# Altium schematic sheet IO_Combo_SD.SchDoc: SD Card
size Tabloid; Date: 09/21/2024; Engineer: Terry D. Schevker; Revision: 1.0; SheetNumber: 3; SheetTotal: 5
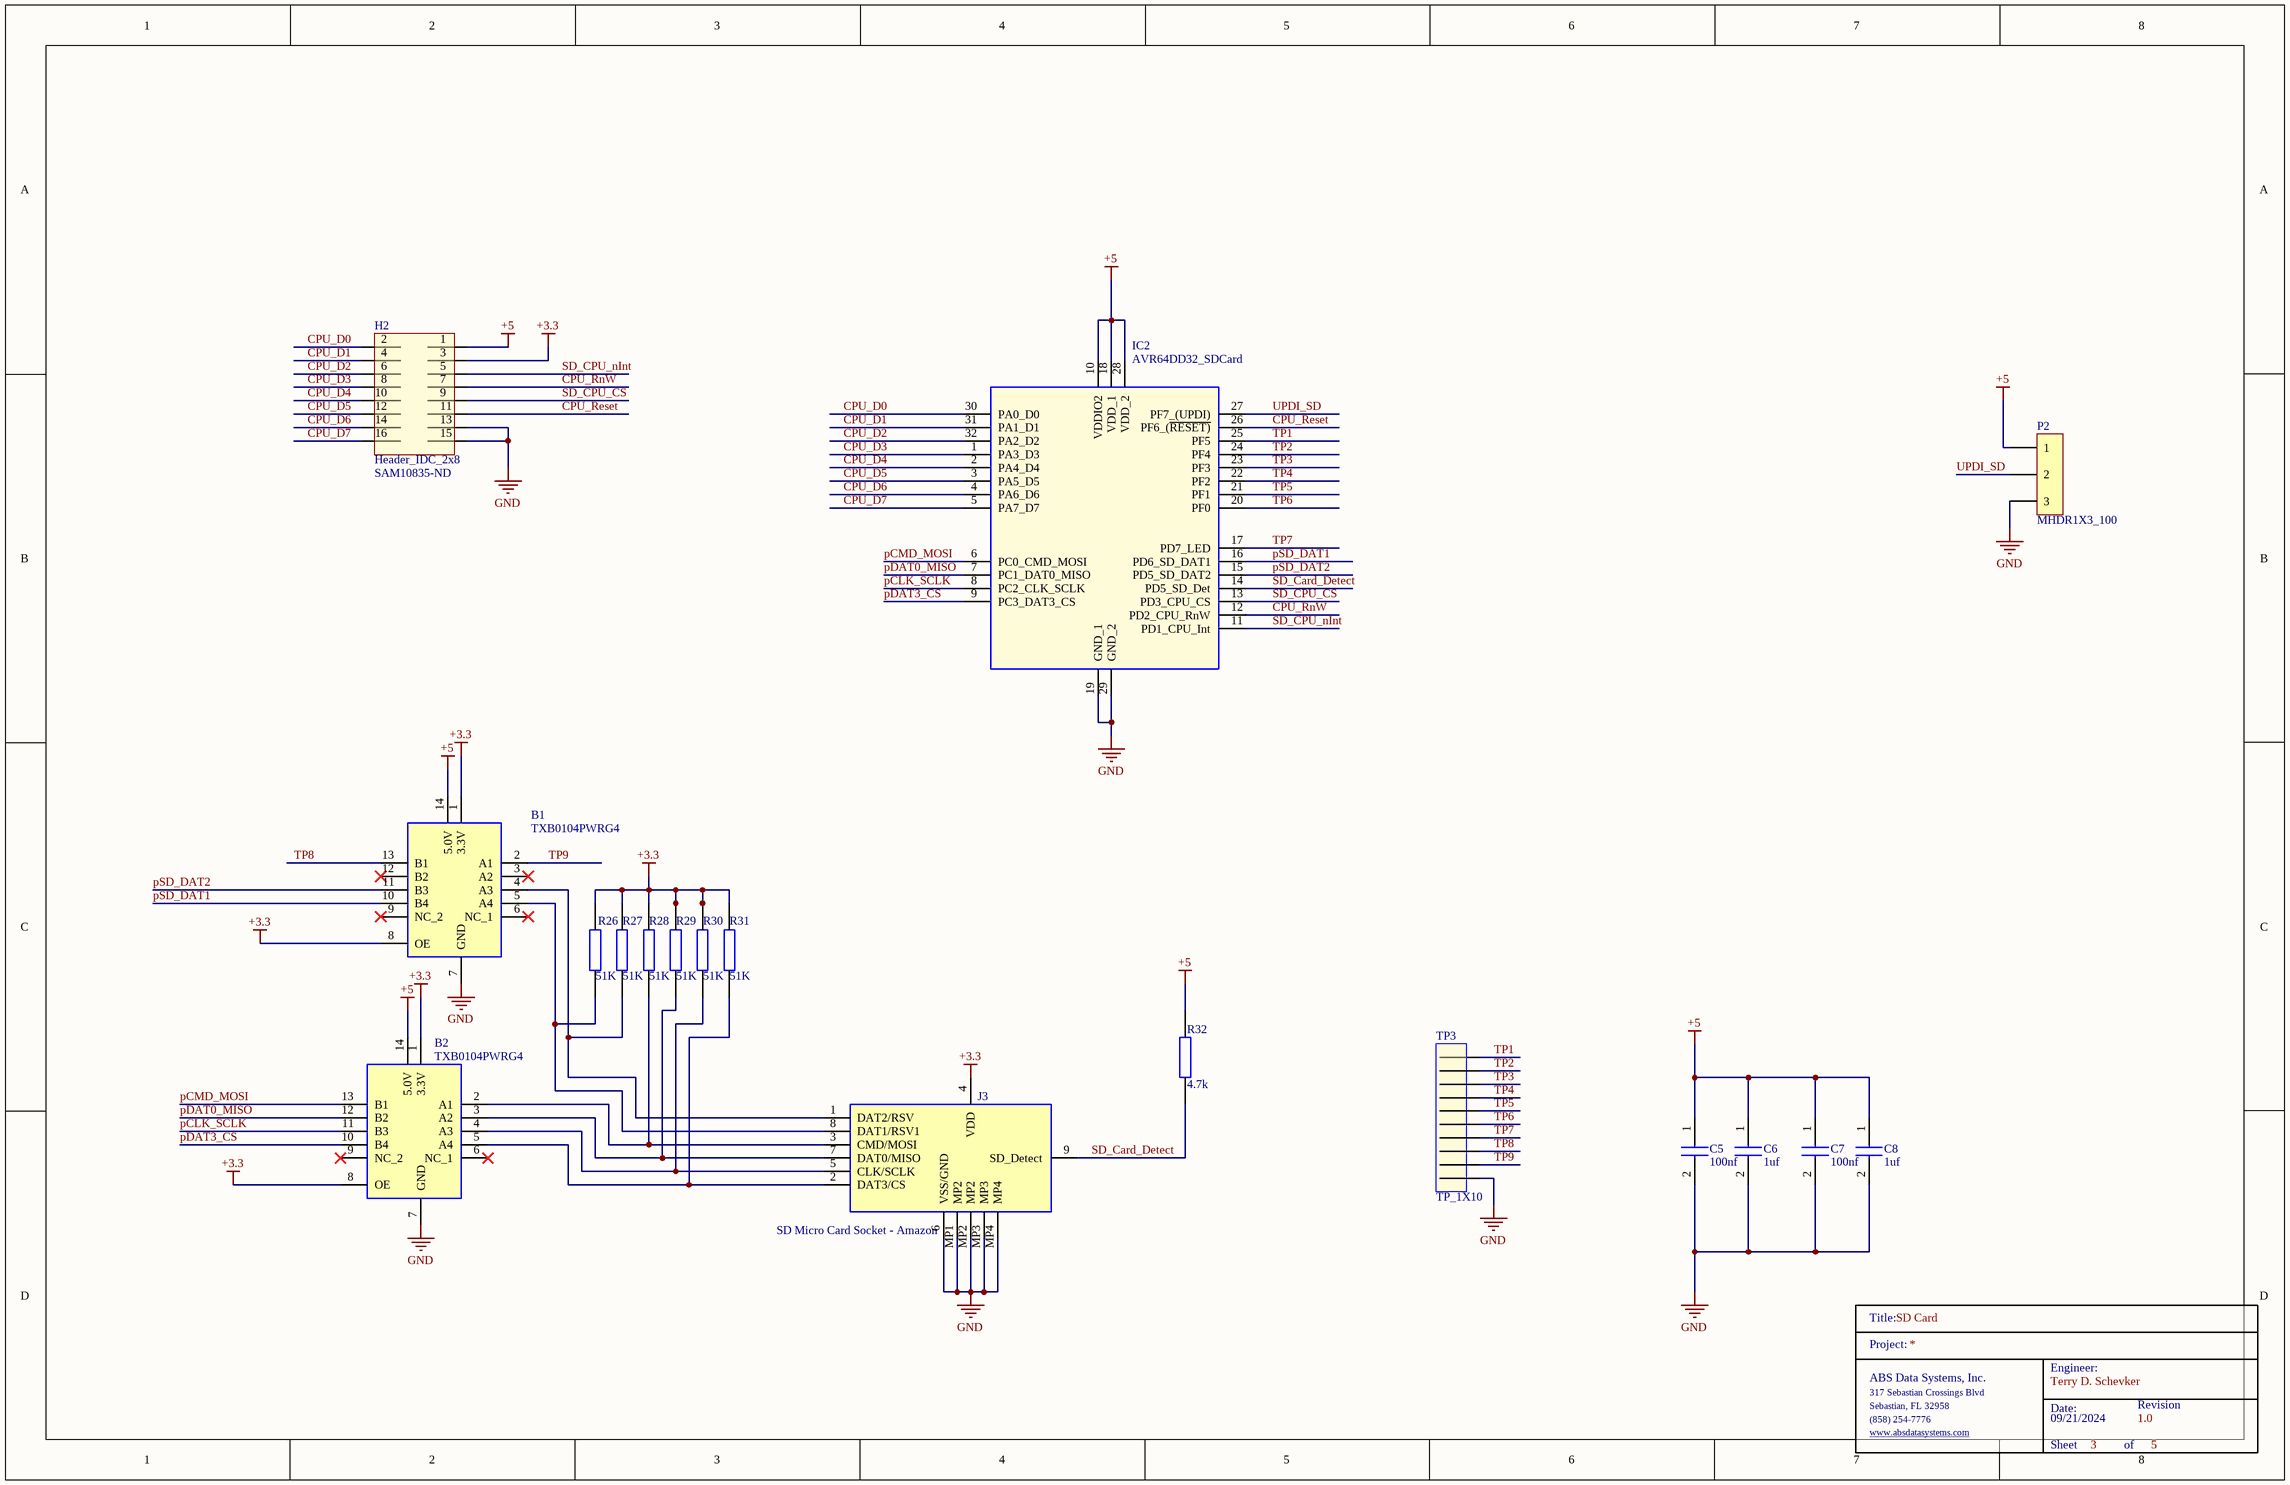
[diagram p0: IO_Combo_SD.SchDoc]

## Parts
B1  TXB0104PWRG4  [SOP65P640X120-14N]
B2  TXB0104PWRG4  [SOP65P640X120-14N]
C5  100nf  [0603]
C6  1uf  [0603]
C7  100nf  [0603]
C8  1uf  [0603]
H2  Header_IDC_2x8  Supplier Part Number 1: SAM10835-ND  [HEADER16]
IC2  AVR64DD32_SDCard  [QFP80P900X900X120-32N]
J3  SD Micro Card Socket - Amazon  [SDMicroConnector]
P2  MHDR1X3_100  [MHDR1X3_100]
R26  51K  [0603]
R27  51K  [0603]
R28  51K  [0603]
R29  51K  [0603]
R30  51K  [0603]
R31  51K  [0603]
R32  4.7k  [0603]
TitleBlock_1  TitleBlock  (value not drawn)  (graphical)
TP3  TP_1X10  [TP_1X10]

## Nets
+3.3: B1.1(3.3V) B1.8(OE) B2.1(3.3V) B2.8(OE) H2.3 J3.4(VDD) R26.1 R27.1 R28.1 R29.1 R30.1 R31.1
+5: B1.14(5.0V) B2.14(5.0V) C5.1 C6.1 C7.1 C8.1 H2.1 IC2.10(VDDIO2) IC2.18(VDD_1) IC2.28(VDD_2) P2.1 R32.2
GND: B1.7(GND) B2.7(GND) C5.2 C6.2 C7.2 C8.2 H2.13 H2.15 IC2.19(GND_1) IC2.29(GND_2) J3.6(VSS/GND) J3.MP1(MP2) J3.MP2 J3.MP3 J3.MP4 P2.3 TP3.10
CPU_D0: H2.2 IC2.30(PA0_D0)
CPU_D1: H2.4 IC2.31(PA1_D1)
CPU_D2: H2.6 IC2.32(PA2_D2)
CPU_D3: H2.8 IC2.1(PA3_D3)
CPU_D4: H2.10 IC2.2(PA4_D4)
CPU_D5: H2.12 IC2.3(PA5_D5)
CPU_D6: H2.14 IC2.4(PA6_D6)
CPU_D7: H2.16 IC2.5(PA7_D7)
CPU_Reset: H2.11 IC2.26(PF6_(~{RESET)})
CPU_RnW: H2.7 IC2.12(PD2_CPU_RnW)
pCLK_SCLK: B2.11(B3) IC2.8(PC2_CLK_SCLK)
pCMD_MOSI: B2.13(B1) IC2.6(PC0_CMD_MOSI)
pDAT0_MISO: B2.12(B2) IC2.7(PC1_DAT0_MISO)
pDAT3_CS: B2.10(B4) IC2.9(PC3_DAT3_CS)
pSD_DAT1: B1.10(B4) IC2.16(PD6_SD_DAT1)
pSD_DAT2: B1.11(B3) IC2.15(PD5_SD_DAT2)
SD_Card_Detect: IC2.14(PD5_SD_Det) J3.9(SD_Detect) R32.1
SD_CPU_CS: H2.9 IC2.13(PD3_CPU_CS)
SD_CPU_nInt: H2.5 IC2.11(PD1_CPU_Int)
TP1: IC2.25(PF5) TP3.1
TP2: IC2.24(PF4) TP3.2
TP3: IC2.23(PF3) TP3.3
TP4: IC2.22(PF2) TP3.4
TP5: IC2.21(PF1) TP3.5
TP6: IC2.20(PF0) TP3.6
TP7: IC2.17(PD7_LED) TP3.7
TP8: B1.13(B1) TP3.8
TP9: B1.2(A1) TP3.9
UPDI_SD: IC2.27(PF7_(UPDI)) P2.2
NetB1_4: B1.4(A3) J3.1(DAT2/RSV) R27.2
NetB1_5: B1.5(A4) J3.8(DAT1/RSV1) R26.2
NetB2_2: B2.2(A1) J3.3(CMD/MOSI) R28.2
NetB2_3: B2.3(A2) J3.7(DAT0/MISO) R29.2
NetB2_4: B2.4(A3) J3.5(CLK/SCLK) R30.2
NetB2_5: B2.5(A4) J3.2(DAT3/CS) R31.2

Not connected (* = marked no-connect by the designer): B1 3(A2)* 6(NC_1)* 9(NC_2)* 12(B2)*; B2 6(NC_1)* 9(NC_2)*

## Notes on the sheet
- (in symbol TitleBlock) Title:; Project:; Engineer:; ABS Data Systems, Inc.; 317 Sebastian Crossings Blvd; Sebastian, FL 32958; Date:; Revision; (858) 254-7776; www.absdatasystems.com; Sheet; of

## Library data of the parts
B1 B2 = TXB0104PWRG4: Texas Instruments TXB0104PWRG4, Voltage Level Translator, 3-State, 1.2  3.6 V, 1.65  5.5 V, 14-Pin TSSOP; Geometry.Height: 1.2mm; Mouser Part Number: 595-TXB0104PWRG4; Mouser Price/Stock: https://www.mouser.co.uk/ProductDetail/Texas-Instruments/TXB0104PWRG4?qs=oFXvjAmG9EjoQ0gyZ%252BZWbg%3D%3D; Manufacturer_Name: Texas Instruments; Manufacturer_Part_Number: TXB0104PWRG4; Datasheet Link: https://datasheet.datasheetarchive.com/originals/distributors/SFDatasheet-6/sf-000131436.pdf
C5 C7 = CL10B104JB8NNNC: Samsung Electro-Mechanics 0603 100nf
C6 C8 = CL10B105KA8NNNL: Samsung Electro-Mechanics 0603 1uf
H2 = Header_IDC_2x8: 16 Pin 2x8 Through Hold IDC Connector; Manufacturer: Samtec; Manufacturer Part Number: TST-108-01-G-D; Number of Contacts: 16; Gender: Male; Connector Type: Male Pin; Pitch: 2.54mm; Row Spacing: 0.1inch; Supplier 1: Digi-Key; RoHS: Yes; Category: Headers and Wire Housings; Stock 1: 227; Pricing 1: 1=2.85000, 10=2.73600, 100=2.28000, 500=1.93800, 1000=1.65300, 5000=1.48200 (USD); Mount: Through Hole; Contact Plating: Gold; Contact Material: Bronze; Housing Material: Polyester; Housing Color: Black; Color: Black; Min Operating Temperature: -55°C; Max Operating Temperature: 125°C; Number of Rows: 2; Termination: Solder; Packaging: Rail/Tube; Orientation: Straight; Number of Positions: 16; Length: 27.94mm; Depth: 9.27mm; Contact Mating Length: 0.25inch; REACH SVHC: No SVHC; ComponentLink1URL: https://datasheet.ciiva.com/739/tst-mkt-739845.pdf?src-supplier=Digi-Key; ComponentLink1Description: https://datasheet.ciiva.com/739/tst-mkt-739845.pdf?src-supplier=Digi-Key; ComponentLink2URL: https://datasheet.ciiva.com/10018/htst-10018510.pdf?src-supplier=Avnet; ComponentLink2Description: https://datasheet.ciiva.com/10018/htst-10018510.pdf?src-supplier=Avnet
IC2 = AVR64DD32_SDCard: Integrated Circuit; Manufacturer_Name: Microchip; Manufacturer_Part_Number: AVR64DD32-I/PT | MULTI-VOLTAGE I/O; Datasheet Link: https://www.microchip.com/en-us/product/AVR64DD32; Height: 1.2mm
J3 = SD_Micro_Socket: Memory Card Connectors 9P R/A SMT MICRO SD HINGE PUSH-PULL; Manufacturer_Name: Hirose; Manufacturer_Part_Number: DM3CS-SF; Geometry.Height: 1.83mm; Mouser Part Number: 798-DM3CSSF; Mouser Price/Stock: https://www.mouser.co.uk/ProductDetail/Hirose-Connector/DM3CS-SF?qs=tTj%252BmQ3KZwbB9K5zh89Rcw%3D%3D; Datasheet Link: https://datasheet.lcsc.com/szlcsc/Hirose-HRS-DM3CS-SF_C202111.pdf
P2 = MHDR1X3_100: Header, 3-Pin; LatestRevisionDate: 17-Jul-2002; LatestRevisionNote: Re-released for DXP Platform.; Publisher: Altium Limited
R26-R31 = RC0603FR-1051KL: YAGEO 0603 51K; Manufacturer_Name: KEMET; Manufacturer_Part_Number: RC0603JR-070RL; Geometry.Height: 0.55mm; Mouser Part Number: 603-RC0603JR-070RL; Mouser Price/Stock: https://www.mouser.co.uk/ProductDetail/YAGEO/RC0603JR-070RL?qs=2cAdsCoAWRGWyPcuXgGiXQ%3D%3D; Datasheet Link: https://datasheet.datasheetarchive.com/originals/distributors/Datasheets_SAMA/902f9e387b938f871d31120f5fc1d65e.pdf
R32 = RC0603FR-104K7L: YAGEO 0603 4.7k; Manufacturer_Name: KEMET; Manufacturer_Part_Number: RC0603JR-070RL; Geometry.Height: 0.55mm; Mouser Part Number: 603-RC0603JR-070RL; Mouser Price/Stock: https://www.mouser.co.uk/ProductDetail/YAGEO/RC0603JR-070RL?qs=2cAdsCoAWRGWyPcuXgGiXQ%3D%3D; Datasheet Link: https://datasheet.datasheetarchive.com/originals/distributors/Datasheets_SAMA/902f9e387b938f871d31120f5fc1d65e.pdf
TP3 = TP_1X10: Manufacturer: Samtec; Manufacturer Part Number: TST-105-01-G-D; Number of Contacts: 16; Gender: Male; Connector Type: Male Pin; Pitch: 2.54mm; Row Spacing: 0.1inch; Supplier 1: Digi-Key; RoHS: Yes; Category: Headers and Wire Housings; Stock 1: 227; Pricing 1: 1=2.85000, 10=2.73600, 100=2.28000, 500=1.93800, 1000=1.65300, 5000=1.48200 (USD); Mount: Through Hole; Contact Plating: Gold; Contact Material: Bronze; Housing Material: Polyester; Housing Color: Black; Color: Black; Min Operating Temperature: -55°C; Max Operating Temperature: 125°C; Number of Rows: 2; Termination: Solder; Packaging: Rail/Tube; Orientation: Straight; Number of Positions: 16; Length: 27.94mm; Depth: 9.27mm; Contact Mating Length: 0.25inch; REACH SVHC: No SVHC; ComponentLink1URL: https://datasheet.ciiva.com/739/tst-mkt-739845.pdf?src-supplier=Digi-Key; ComponentLink1Description: https://datasheet.ciiva.com/739/tst-mkt-739845.pdf?src-supplier=Digi-Key; ComponentLink2URL: https://datasheet.ciiva.com/10018/htst-10018510.pdf?src-supplier=Avnet; ComponentLink2Description: https://datasheet.ciiva.com/10018/htst-10018510.pdf?src-supplier=Avnet